# Altium schematic sheet sch.SchDoc
size A
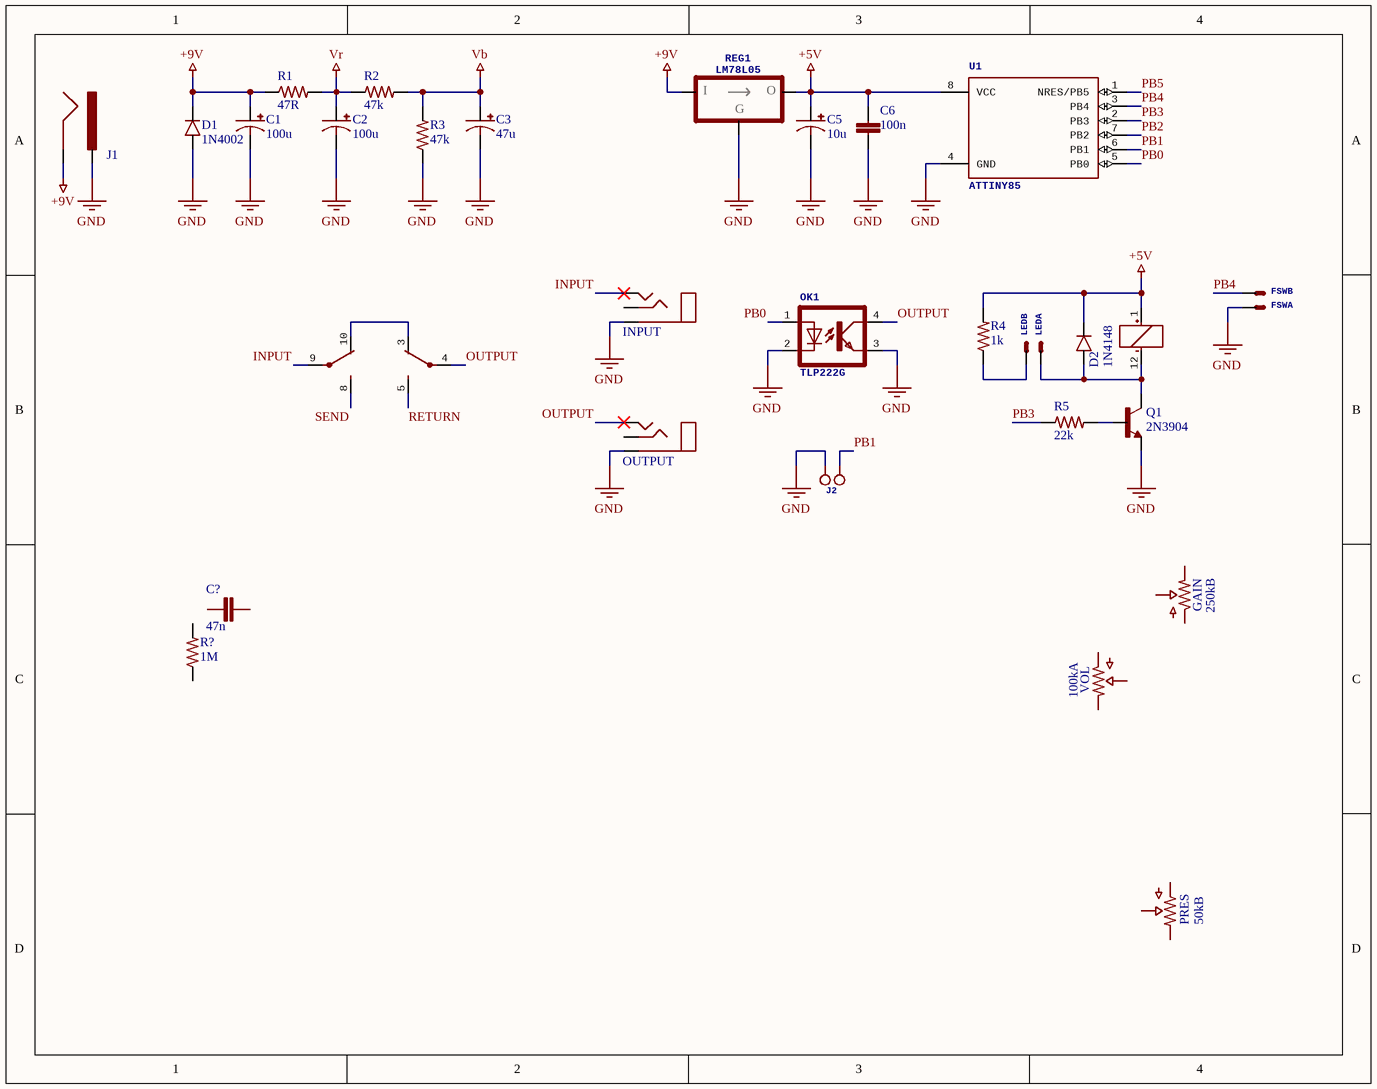
[diagram p0: sch.SchDoc]

## Parts
C1  100u  [ELEC_063_025]
C2  100u  [ELEC_063_025]
C3  47u  [ELEC_050_020]
C5  10u  [ELEC_040_020]
C6  100n  [CER_050]
C?  47n  [FILMBOX_SMALL]
D1  1N4002  [DO41_2]
D2  1N4148  [DO35_2]
FSW  (no value)  [JST-XH-02]  (parts A,B of 2)
GAIN  250kB  [ALPHA_16mm_BOTTOM]
INPUT  (no value)  [STEREO]
J1  DC_JACK  [DC_JACK]  (value not drawn)
J2  HEADER_2PINS  [HEADER_2PINS]  (value not drawn)
K1  (no value)  [NA5]  (parts A,B,C of 3)
LED  (no value)  [JST-XH-02]  (parts A,B of 2)
OK1  TLP222G  [DIL4]
OUTPUT  (no value)  [STEREO]
PRES  50kB  [ALPHA_16mm_BOTTOM]
Q1  2N3904  [TO92]
R1  47R  [R_3_47R_025W]
R2  47k  [R_3_47k_025W]
R3  47k  [R_3_47k_025W]
R4  1k  [R_3_1k_025W]
R5  22k  [R_3_22k_025W]
R?  1M  [R_3_1M_025W]
REG1  LM78L05  [TO92]
U1  ATTINY85  [DIP8]
VOL  100kA  [ALPHA_16mm_BOTTOM]

## Nets
+5V: C5.+ C6.2 D2.C K1.1(+) R4.2 REG1.3(VO) U1.8(VCC)
+9V: C1.+ D1.C J1.GND R1.1 REG1.1(VI)
GND: C1.- C2.- C3.- C5.- C6.1 D1.A FSW.2(S) INPUT.S J1.PWR J2.1 OK1.2(C) OK1.3(EMIT) OUTPUT.S Q1.3(E) R3.1 REG1.2(GND) U1.4(GND)
Vb: C3.+ R2.2 R3.2
Vr: C2.+ R1.2 R2.1
INPUT: INPUT.T K1.9(P)
OUTPUT: K1.4(P) OK1.4(COL) OUTPUT.T
PB0: OK1.1(A) U1.5(PB0)
PB1: J2.2 U1.6(PB1)
PB2: U1.7(PB2)
PB3: R5.1 U1.2(PB3)
PB4: FSW.1(S) U1.3(PB4)
PB5: U1.1(NRES/PB5)
RETURN: K1.5(S)
SEND: K1.8(S)
NetD2_A: D2.A K1.12(-) LED.2(S) Q1.1(C)
NetK1_3: K1.3(O) K1.10(O)
NetLED_1: LED.1(S) R4.1
NetQ1_2: Q1.2(B) R5.2

Not connected (* = marked no-connect by the designer): C? 1 2; GAIN 1 2 3; INPUT R; OUTPUT R; PRES 1 2 3; R? 1 2; VOL 1 2 3

## Notes on the sheet
- (in symbol LM78L05) I; O; G

## Library data of the parts
C1 C2 = ELEC_100u_25V
C3 = ELEC_47u_25V
C5 = ELEC_10u_50V
C6 = CER_100n
C? = FILMBOX_47n
FSW LED = JST-XH-02
GAIN PRES VOL = ALPHA_16mm
INPUT OUTPUT = STEREO
K1 = NA5W-K: OC_FARNELL: unknown; OC_NEWARK: unknown
R1 = R_3_47R_025W
R2 R3 = R_3_47k_025W
R4 = R_3_1k_025W
R5 = R_3_22k_025W
R? = R_3_1M_025W
OK1 = TLP222G: OC_FARNELL: unknown; OC_NEWARK: unknown